# Altium schematic sheet connectors.SchDoc
size A3
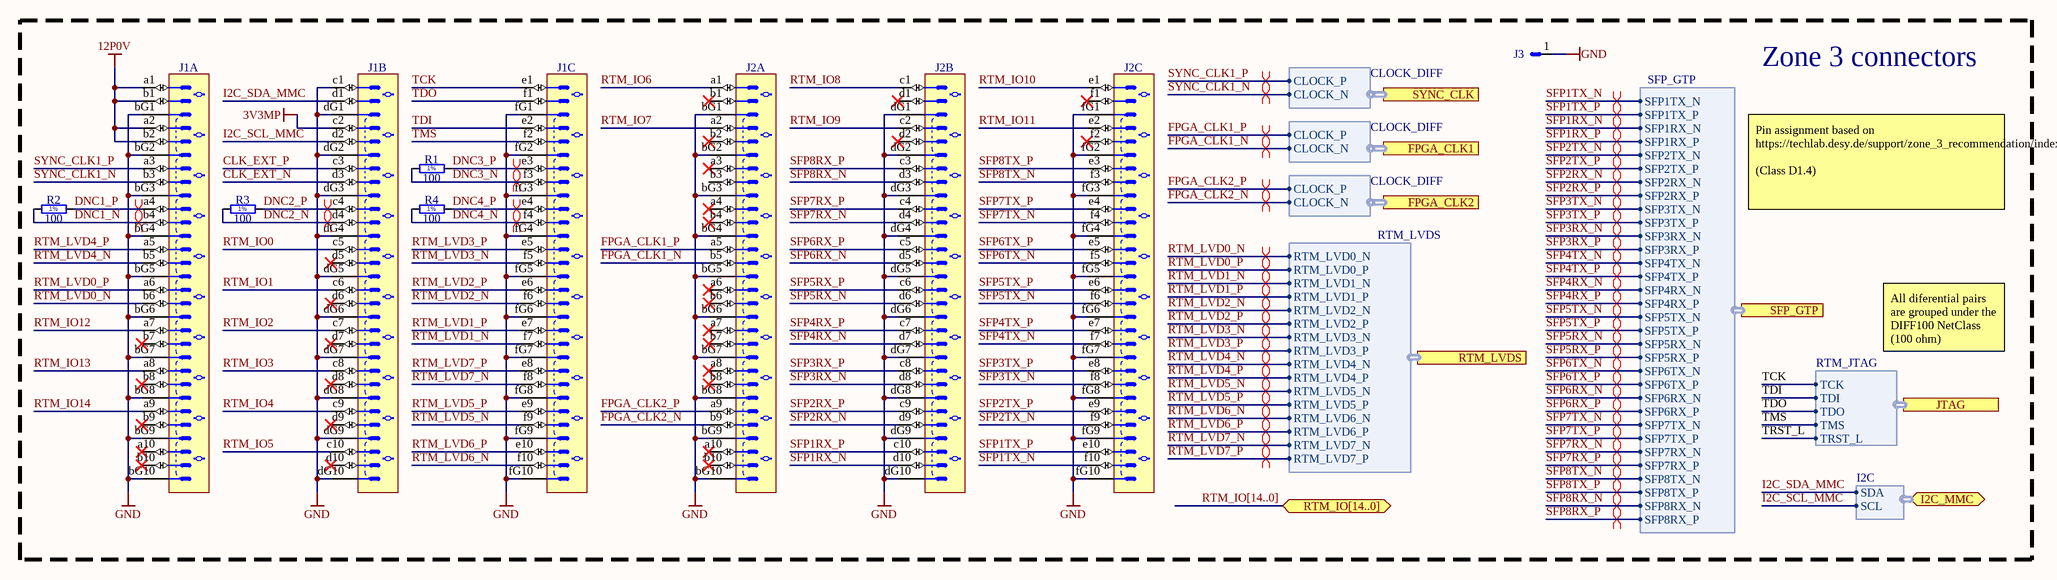
[diagram p0: connectors.SchDoc]

## Parts
J1  Advanced TCA  [TYCO_6469183-1]  (value not drawn)  (parts A,B,C of 3)
J2  Advanced TCA  [TYCO_6469183-1]  (value not drawn)  (parts A,B,C of 3)
J3  (no value)  [TYCO_1469265-1]
R1  100  [RESC1608X55N]
R2  100  [RESC1608X55N]
R3  100  [RESC1608X55N]
R4  100  [RESC1608X55N]

## Blocks framed on the sheet
Zone 3 connectors: J1-J3 R1-R4

## Ports
FPGA_CLK1 (harness CLOCK_DIFF), FPGA_CLK2 (harness CLOCK_DIFF), I2C_MMC (bidir, harness I2C), JTAG (harness RTM_JTAG), RTM_IO[14..0] (bidir, harness JTAG), RTM_LVDS (harness RTM_LVDS), SFP_GTP (harness SFP_GTP), SYNC_CLK (harness CLOCK_DIFF)

## Harnesses
RTM_LVDS: RTM_LVD0_N, RTM_LVD0_P, RTM_LVD1_N, RTM_LVD1_P, RTM_LVD2_N, RTM_LVD2_P, RTM_LVD3_N, RTM_LVD3_P, RTM_LVD4_N, RTM_LVD4_P, RTM_LVD5_N, RTM_LVD5_P, RTM_LVD6_N, RTM_LVD6_P, RTM_LVD7_N, RTM_LVD7_P
SFP_GTP: SFP1RX_N, SFP1RX_P, SFP1TX_N, SFP1TX_P, SFP2TX_N, SFP2TX_P, SFP2RX_N, SFP2RX_P, SFP3TX_N, SFP3TX_P, SFP3RX_N, SFP3RX_P, SFP4TX_N, SFP4TX_P, SFP4RX_N, SFP4RX_P, SFP5TX_N, SFP5TX_P, SFP5RX_N, SFP5RX_P, SFP6TX_N, SFP6TX_P, SFP6RX_N, SFP6RX_P, SFP7TX_N, SFP7TX_P, SFP7RX_N, SFP7RX_P, SFP8TX_N, SFP8TX_P, SFP8RX_N, SFP8RX_P
RTM_JTAG: TCK, TDI, TDO, TMS, TRST_L
CLOCK_DIFF: CLOCK_P, CLOCK_N
I2C: SDA, SCL

## Nets
3V3MP: J1.c2
12P0V: J1.a1 J1.a2 J1.b1 J1.b2
GND: J1.bG1 J1.bG2 J1.bG3 J1.bG4 J1.bG5 J1.bG6 J1.bG7 J1.bG8 J1.bG9 J1.bG10 J1.c1 J1.dG1 J1.dG2 J1.dG3 J1.dG4 J1.dG5 J1.dG6 J1.dG7 J1.dG8 J1.dG9 J1.dG10 J1.fG1 J1.fG2 J1.fG3 J1.fG4 J1.fG5 J1.fG6 J1.fG7 J1.fG8 J1.fG9 J1.fG10 J2.bG1 J2.bG2 J2.bG3 J2.bG4 J2.bG5 J2.bG6 J2.bG7 J2.bG8 J2.bG9 J2.bG10 J2.dG1 J2.dG2 J2.dG3 J2.dG4 J2.dG5 J2.dG6 J2.dG7 J2.dG8 J2.dG9 J2.dG10 J2.fG1 J2.fG2 J2.fG3 J2.fG4 J2.fG5 J2.fG6 J2.fG7 J2.fG8 J2.fG9 J2.fG10 J3.1
CLK_EXT_N: J1.d3
CLK_EXT_P: J1.c3
DNC1_N: J1.b4 R2.1
DNC1_P: J1.a4 R2.2
DNC2_N: J1.d4 R3.1
DNC2_P: J1.c4 R3.2
DNC3_N: J1.f3 R1.1
DNC3_P: J1.e3 R1.2
DNC4_N: J1.f4 R4.1
DNC4_P: J1.e4 R4.2
FPGA_CLK1_N: J2.b5 ; port FPGA_CLK1.CLOCK_N
FPGA_CLK1_P: J2.a5 ; port FPGA_CLK1.CLOCK_P
FPGA_CLK2_N: J2.b9 ; port FPGA_CLK2.CLOCK_N
FPGA_CLK2_P: J2.a9 ; port FPGA_CLK2.CLOCK_P
I2C_SCL_MMC: J1.d2 ; port I2C_MMC.SCL
I2C_SDA_MMC: J1.d1 ; port I2C_MMC.SDA
RTM_IO0: J1.c5
RTM_IO1: J1.c6
RTM_IO2: J1.c7
RTM_IO3: J1.c8
RTM_IO4: J1.c9
RTM_IO5: J1.c10
RTM_IO6: J2.a1
RTM_IO7: J2.a2
RTM_IO8: J2.c1
RTM_IO9: J2.c2
RTM_IO10: J2.e1
RTM_IO11: J2.e2
RTM_IO12: J1.a7
RTM_IO13: J1.a8
RTM_IO14: J1.a9
RTM_LVD0_N: J1.b6 ; port RTM_LVDS.RTM_LVD0_N
RTM_LVD0_P: J1.a6 ; port RTM_LVDS.RTM_LVD0_P
RTM_LVD1_N: J1.f7 ; port RTM_LVDS.RTM_LVD1_N
RTM_LVD1_P: J1.e7 ; port RTM_LVDS.RTM_LVD1_P
RTM_LVD2_N: J1.f6 ; port RTM_LVDS.RTM_LVD2_N
RTM_LVD2_P: J1.e6 ; port RTM_LVDS.RTM_LVD2_P
RTM_LVD3_N: J1.f5 ; port RTM_LVDS.RTM_LVD3_N
RTM_LVD3_P: J1.e5 ; port RTM_LVDS.RTM_LVD3_P
RTM_LVD4_N: J1.b5 ; port RTM_LVDS.RTM_LVD4_N
RTM_LVD4_P: J1.a5 ; port RTM_LVDS.RTM_LVD4_P
RTM_LVD5_N: J1.f9 ; port RTM_LVDS.RTM_LVD5_N
RTM_LVD5_P: J1.e9 ; port RTM_LVDS.RTM_LVD5_P
RTM_LVD6_N: J1.f10 ; port RTM_LVDS.RTM_LVD6_N
RTM_LVD6_P: J1.e10 ; port RTM_LVDS.RTM_LVD6_P
RTM_LVD7_N: J1.f8 ; port RTM_LVDS.RTM_LVD7_N
RTM_LVD7_P: J1.e8 ; port RTM_LVDS.RTM_LVD7_P
SFP1RX_N: J2.d10 ; port SFP_GTP.SFP1RX_N
SFP1RX_P: J2.c10 ; port SFP_GTP.SFP1RX_P
SFP1TX_N: J2.f10 ; port SFP_GTP.SFP1TX_N
SFP1TX_P: J2.e10 ; port SFP_GTP.SFP1TX_P
SFP2RX_N: J2.d9 ; port SFP_GTP.SFP2RX_N
SFP2RX_P: J2.c9 ; port SFP_GTP.SFP2RX_P
SFP2TX_N: J2.f9 ; port SFP_GTP.SFP2TX_N
SFP2TX_P: J2.e9 ; port SFP_GTP.SFP2TX_P
SFP3RX_N: J2.d8 ; port SFP_GTP.SFP3RX_N
SFP3RX_P: J2.c8 ; port SFP_GTP.SFP3RX_P
SFP3TX_N: J2.f8 ; port SFP_GTP.SFP3TX_N
SFP3TX_P: J2.e8 ; port SFP_GTP.SFP3TX_P
SFP4RX_N: J2.d7 ; port SFP_GTP.SFP4RX_N
SFP4RX_P: J2.c7 ; port SFP_GTP.SFP4RX_P
SFP4TX_N: J2.f7 ; port SFP_GTP.SFP4TX_N
SFP4TX_P: J2.e7 ; port SFP_GTP.SFP4TX_P
SFP5RX_N: J2.d6 ; port SFP_GTP.SFP5RX_N
SFP5RX_P: J2.c6 ; port SFP_GTP.SFP5RX_P
SFP5TX_N: J2.f6 ; port SFP_GTP.SFP5TX_N
SFP5TX_P: J2.e6 ; port SFP_GTP.SFP5TX_P
SFP6RX_N: J2.d5 ; port SFP_GTP.SFP6RX_N
SFP6RX_P: J2.c5 ; port SFP_GTP.SFP6RX_P
SFP6TX_N: J2.f5 ; port SFP_GTP.SFP6TX_N
SFP6TX_P: J2.e5 ; port SFP_GTP.SFP6TX_P
SFP7RX_N: J2.d4 ; port SFP_GTP.SFP7RX_N
SFP7RX_P: J2.c4 ; port SFP_GTP.SFP7RX_P
SFP7TX_N: J2.f4 ; port SFP_GTP.SFP7TX_N
SFP7TX_P: J2.e4 ; port SFP_GTP.SFP7TX_P
SFP8RX_N: J2.d3 ; port SFP_GTP.SFP8RX_N
SFP8RX_P: J2.c3 ; port SFP_GTP.SFP8RX_P
SFP8TX_N: J2.f3 ; port SFP_GTP.SFP8TX_N
SFP8TX_P: J2.e3 ; port SFP_GTP.SFP8TX_P
SYNC_CLK1_N: J1.b3 ; port SYNC_CLK.CLOCK_N
SYNC_CLK1_P: J1.a3 ; port SYNC_CLK.CLOCK_P
TCK: J1.e1 ; port JTAG.TCK
TDI: J1.e2 ; port JTAG.TDI
TDO: J1.f1 ; port JTAG.TDO
TMS: J1.f2 ; port JTAG.TMS
TRST_L: port JTAG.TRST_L

Not connected (* = marked no-connect by the designer): J1 a10* b7* b8* b9* b10* d5* d6* d7* d8* d9* d10*; J2 a3* a4* a6* a7* a8* a10* b1* b2* b3 b4* b6* b7* b8* b10* d1* d2* f1* f2*

## Buses and harness runs
bus RTM_IO[14..0]

## Layout directives
differential pair; differential pair class DIFF100: DNC1_N, DNC1_P, DNC2_N, DNC2_P, DNC3_N, DNC3_P, DNC4_N, DNC4_P, FPGA_CLK1_N, FPGA_CLK1_P, FPGA_CLK2_N, FPGA_CLK2_P, RTM_LVD0_N, RTM_LVD0_P, RTM_LVD1_N, RTM_LVD1_P, RTM_LVD2_N, RTM_LVD2_P, RTM_LVD3_N, RTM_LVD3_P, RTM_LVD4_N, RTM_LVD4_P, RTM_LVD5_N, RTM_LVD5_P, RTM_LVD6_N, RTM_LVD6_P, RTM_LVD7_N, RTM_LVD7_P, SFP1RX_N, SFP1RX_P, SFP1TX_N, SFP1TX_P, SFP2RX_N, SFP2RX_P, SFP2TX_N, SFP2TX_P, SFP3RX_N, SFP3RX_P, SFP3TX_N, SFP3TX_P, SFP4RX_N, SFP4RX_P, SFP4TX_N, SFP4TX_P, SFP5RX_N, SFP5RX_P, SFP5TX_N, SFP5TX_P, SFP6RX_N, SFP6RX_P, SFP6TX_N, SFP6TX_P, SFP7RX_N, SFP7RX_P, SFP7TX_N, SFP7TX_P, SFP8RX_N, SFP8RX_P, SFP8TX_N, SFP8TX_P, SYNC_CLK1_N, SYNC_CLK1_P

## Notes on the sheet
- Pin assignment based on https://techlab.desy.de/support/zone_3_recommendation/index_eng.html
  (Class D1.4)
- All diferential pairs are grouped under the DIFF100 NetClass (100 ohm)
- Title:
- Date:
- Project:
- Drawn by:
- Time:
- Revised by:
- Sheet
- of
- Grupo de diagnóstico do feixe -
  DIG - LNLS
- Copyright CNPEM 2020.
  This documentation describes Open Hardware and is licensed under the CERN OHL S v2. You may redistribute and modify this documentation under the terms of the CERN OHL S v2. (https://www.ohwr.org/cernohl). This documentation is distributed WITHOUT ANY EXPRESS OR IMPLIED WARRANTY, INCLUDING OF MERCHANTABILITY, SATISFACTORY QUALITY AND FITNESS FOR A PARTICULAR PURPOSE. Please see the CERN OHL S v2 for applicable conditions.
- File:
- (in symbol R0603_100R_1%_0.1W_100PPM) 1%

## Library data of the parts
J1 J2 = TYCO_6469183-1: Connector 60 ATCA Male 30 Pairs (60 Signals) + 3x10 Ground; Part Description: 60 Positions, Pitch 2.5mm,  Advanced TCA, Z-PACK HM-Zd Right Angle Press Fit Header; Manufacturer: TYCO ELECTRONICS; Part Number: TYCO_6469183-1; Component Kind: Standard; Component Type: Standard; Pin Count: 90; Family: Advanced TCA; Mounted: Yes; Socket: No; SMD: No; PressFit: Yes; Sense: No; Status: None; Manufacturer Part Number: 6469183-1; ComponentHeight: 13.31mm; HelpURL: \\cern.ch\dfs\Applications\Altium\Datasheets\TYCO_6469183-1.pdf; Author: CERN DEM JLC; CreateDate: 28/08/2013; LatestRevisionDate: 28/08/2013
J3 = TYCO_1469265-1: Single Pin Male; Part Description: Universal Right Angle Male Power Module Guide (keyed); Manufacturer: TYCO ELECTRONICS; PressFit: No; Part Number: TYCO_1469265-1; Component Kind: Standard; Component Type: Standard; Pin Count: 1; Mounted: Yes; Socket: No; SMD: No; Sense: No; Status: None; Manufacturer Part Number: 1469265-1; ComponentHeight: 9.78mm; HelpURL: \\cern.ch\dfs\Applications\Altium\Datasheets\TYCO_1469265-1.pdf; Author: CERN DEM JLC; CreateDate: 28/08/2013; LatestRevisionDate: 28/08/2013
R1 R3 R4 = R0603_100R_1%_0.1W_100PPM: Resistor - 1%; Part Description: General Purpose Thick Film Chip Resistor; Manufacturer: GENERIC; Manufacturer1 Part Number: NRC06F4700TRF; Power: 0.1W; TC: ±100ppm/°C; Part Number: R0603_100R_1%_0.1W_100PPM; Component Kind: Standard; Component Type: Standard; Pin Count: 2; Value: 100; Status: Preferred; Tolerance: ±1%; Manufacturer Part Number: R0603_100R_1%_0.1W_100PPM; Case: 0603; Mounted: Yes; Socket: No; SMD: Yes; Manufacturer1 Example: NIC COMPONENT; Manufacturer1 ComponentHeight: 0.55mm; HelpURL: \\cern.ch\dfs\Applications\Altium\Datasheets\R0603_NIC_NRC.pdf; Author: CERN DEM JLC; CreateDate: 03/12/2007; LatestRevisionDate: 13/03/2008; Sense: No
R2 = R0603_100R_1%_0.1W_100PPM: Resistor - 1%; Part Description: General Purpose Thick Film Chip Resistor; Manufacturer: GENERIC; Manufacturer1 Part Number: NRC06F1000TRF; Power: 0.1W; TC: ±100ppm/°C; Part Number: R0603_100R_1%_0.1W_100PPM; Component Kind: Standard; Component Type: Standard; Pin Count: 2; Value: 100; Status: Preferred; Tolerance: ±1%; Manufacturer Part Number: R0603_100R_1%_0.1W_100PPM; Case: 0603; Mounted: Yes; Sense: No; Socket: No; SMD: Yes; Manufacturer1 Example: NIC COMPONENT; Manufacturer1 ComponentHeight: 0.55mm; HelpURL: \\cern.ch\dfs\Applications\Altium\Datasheets\R0603_NIC_NRC.pdf; Author: CERN DEM JLC; CreateDate: 03/12/2007; LatestRevisionDate: 13/03/2008